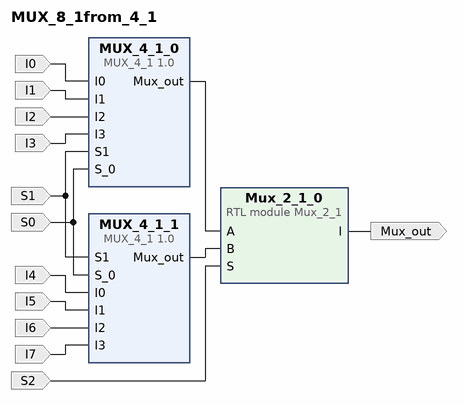
[diagram p0: block diagram of the top level]
# Vivado block design MUX_8_1from_4_1, xc7z010clg400-1, Vivado 2019.1
create_bd_design MUX_8_1from_4_1

create_bd_port -dir I I0
create_bd_port -dir I I1
create_bd_port -dir I I2
create_bd_port -dir I I3
create_bd_port -dir I I4
create_bd_port -dir I I5
create_bd_port -dir I I6
create_bd_port -dir I I7
create_bd_port -dir I S1
create_bd_port -dir I S0
create_bd_port -dir I S2
create_bd_port -dir O Mux_out

create_bd_cell -type ip -vlnv xilinx.com:user:MUX_4_1:1.0 MUX_4_1_0
create_bd_cell -type ip -vlnv xilinx.com:user:MUX_4_1:1.0 MUX_4_1_1
create_bd_cell -type module -reference Mux_2_1 Mux_2_1_0

# ---- connections ----

connect_bd_net [get_bd_pins MUX_4_1_0/Mux_out] [get_bd_pins Mux_2_1_0/A]
connect_bd_net [get_bd_pins MUX_4_1_1/Mux_out] [get_bd_pins Mux_2_1_0/B]
connect_bd_net -net I0_1 [get_bd_ports I0] [get_bd_pins MUX_4_1_0/I0]
connect_bd_net -net I1_1 [get_bd_ports I1] [get_bd_pins MUX_4_1_0/I1]
connect_bd_net -net I2_1 [get_bd_ports I2] [get_bd_pins MUX_4_1_0/I2]
connect_bd_net -net I3_1 [get_bd_ports I3] [get_bd_pins MUX_4_1_0/I3]
connect_bd_net -net I4_1 [get_bd_ports I4] [get_bd_pins MUX_4_1_1/I0]
connect_bd_net -net I5_1 [get_bd_ports I5] [get_bd_pins MUX_4_1_1/I1]
connect_bd_net -net I6_1 [get_bd_ports I6] [get_bd_pins MUX_4_1_1/I2]
connect_bd_net -net I7_1 [get_bd_ports I7] [get_bd_pins MUX_4_1_1/I3]
connect_bd_net -net S1_0_1 [get_bd_ports S1] [get_bd_pins MUX_4_1_0/S1] [get_bd_pins MUX_4_1_1/S1]
connect_bd_net -net S_0_0_1 [get_bd_ports S0] [get_bd_pins MUX_4_1_0/S_0] [get_bd_pins MUX_4_1_1/S_0]
connect_bd_net -net S_0_1 [get_bd_ports S2] [get_bd_pins Mux_2_1_0/S]
connect_bd_net [get_bd_pins Mux_2_1_0/I] [get_bd_ports Mux_out]

validate_bd_design
save_bd_design
